# EAGLE design PK_MUV (EAGLE 9.1.3)
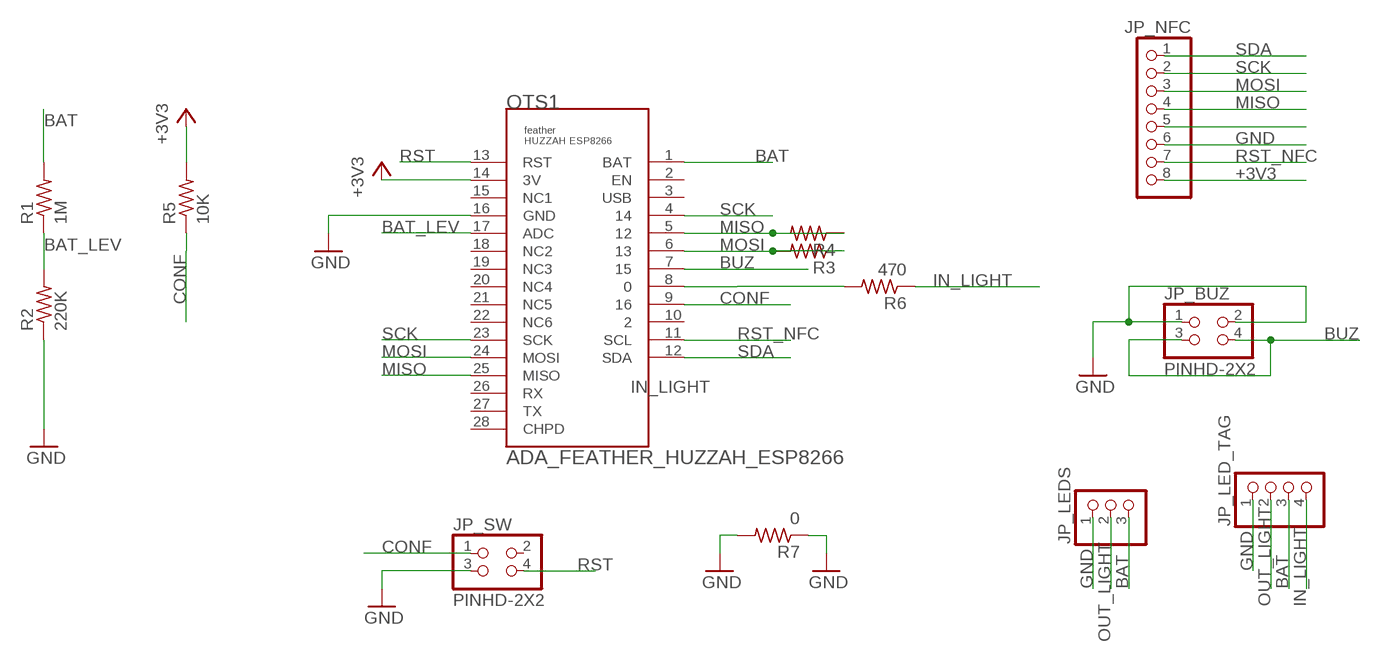
[diagram p0: schematic, sheet 1]

## Parts
JP_BUZ  PINHD-2X2  [2X2]
JP_LED_TAG  HEADER-1X4  [1X04_OVAL]
JP_LEDS  HEADER-1X3  [1X03_OVAL]
JP_NFC  HEADER-1X8  [1X08_OVAL]
JP_SW  PINHD-2X2  [2X2]
OTS1  ADA_FEATHER_HUZZAH_ESP8266  [ADA_FEATHER_HUZZAH_ESP8266]
R1  1M  R-US_M1206  [M1206]
R2  220K  R-US_M1206  [M1206]
R3  R-US_M1206  [M1206]
R4  R-US_M1206  [M1206]
R5  10K  R-US_M1206  [M1206]
R6  470  R-US_M1206  [M1206]
R7  0  R-US_M1206  [M1206]

## Nets
+3V3: JP_NFC.8 OTS1.14(3V) R5.2
BAT [power]: JP_LED_TAG.3 JP_LEDS.3 OTS1.1(BAT) R1.2
BAT_LEV: OTS1.17(ADC) R1.1 R2.2
BUZ: JP_BUZ.3 JP_BUZ.4 OTS1.7
CONF: JP_SW.1 OTS1.9 R5.1
GND [power]: JP_BUZ.1 JP_BUZ.2 JP_LED_TAG.1 JP_LEDS.1 JP_NFC.6 JP_SW.3 OTS1.16(GND) R2.1 R7.1 R7.2
IN_LIGHT: JP_LED_TAG.4 R6.1
MISO: JP_NFC.4 OTS1.5 OTS1.25(MISO) R4.1 R4.2
MOSI: JP_NFC.3 OTS1.6 OTS1.24(MOSI) R3.1 R3.2
N$1: OTS1.8 R6.2
N$5: JP_NFC.5
OUT_LIGHT: JP_LED_TAG.2 JP_LEDS.2
RST: JP_SW.4 OTS1.13(RST)
RST_NFC: JP_NFC.7 OTS1.11(SCL)
SCK: JP_NFC.2 OTS1.4 OTS1.23(SCK)
SDA: JP_NFC.1 OTS1.12(SDA)
Unconnected: JP_SW.2 OTS1.2(EN) OTS1.10 OTS1.15(NC1) OTS1.18(NC2) OTS1.19(NC3) OTS1.20(NC4) OTS1.21(NC5) OTS1.22(NC6) OTS1.26(RX) OTS1.27(TX) OTS1.28(CHPD)

## Power pins joined to a net without a drawn wire
USB: OTS1.3(USB)

## Library data of the parts
JP_BUZ JP_SW = ep:PINHD-2X2
JP_LED_TAG = microbuilder:HEADER-1X4: PIN HEADER
JP_LEDS = microbuilder:HEADER-1X3: PIN HEADER
JP_NFC = microbuilder:HEADER-1X8: PIN HEADER
OTS1 = OTS:ADA_FEATHER_HUZZAH_ESP8266: Manufacture: Adafruit Prduct number: 2821 Type: development board Measures: 51mm x 23mm x 8mm without headers Supporting materilas: product page <https://www.adafruit.com/product/2821>
R1-R7 = resistor:R-US_: RESISTOR, American symbol

## Net classes
0 default: width 0.3 mm, drill 0.8 mm, clearance 0.4 mm
1 power: width 1 mm, drill 0.8 mm, clearance 0.4 mm

## Board
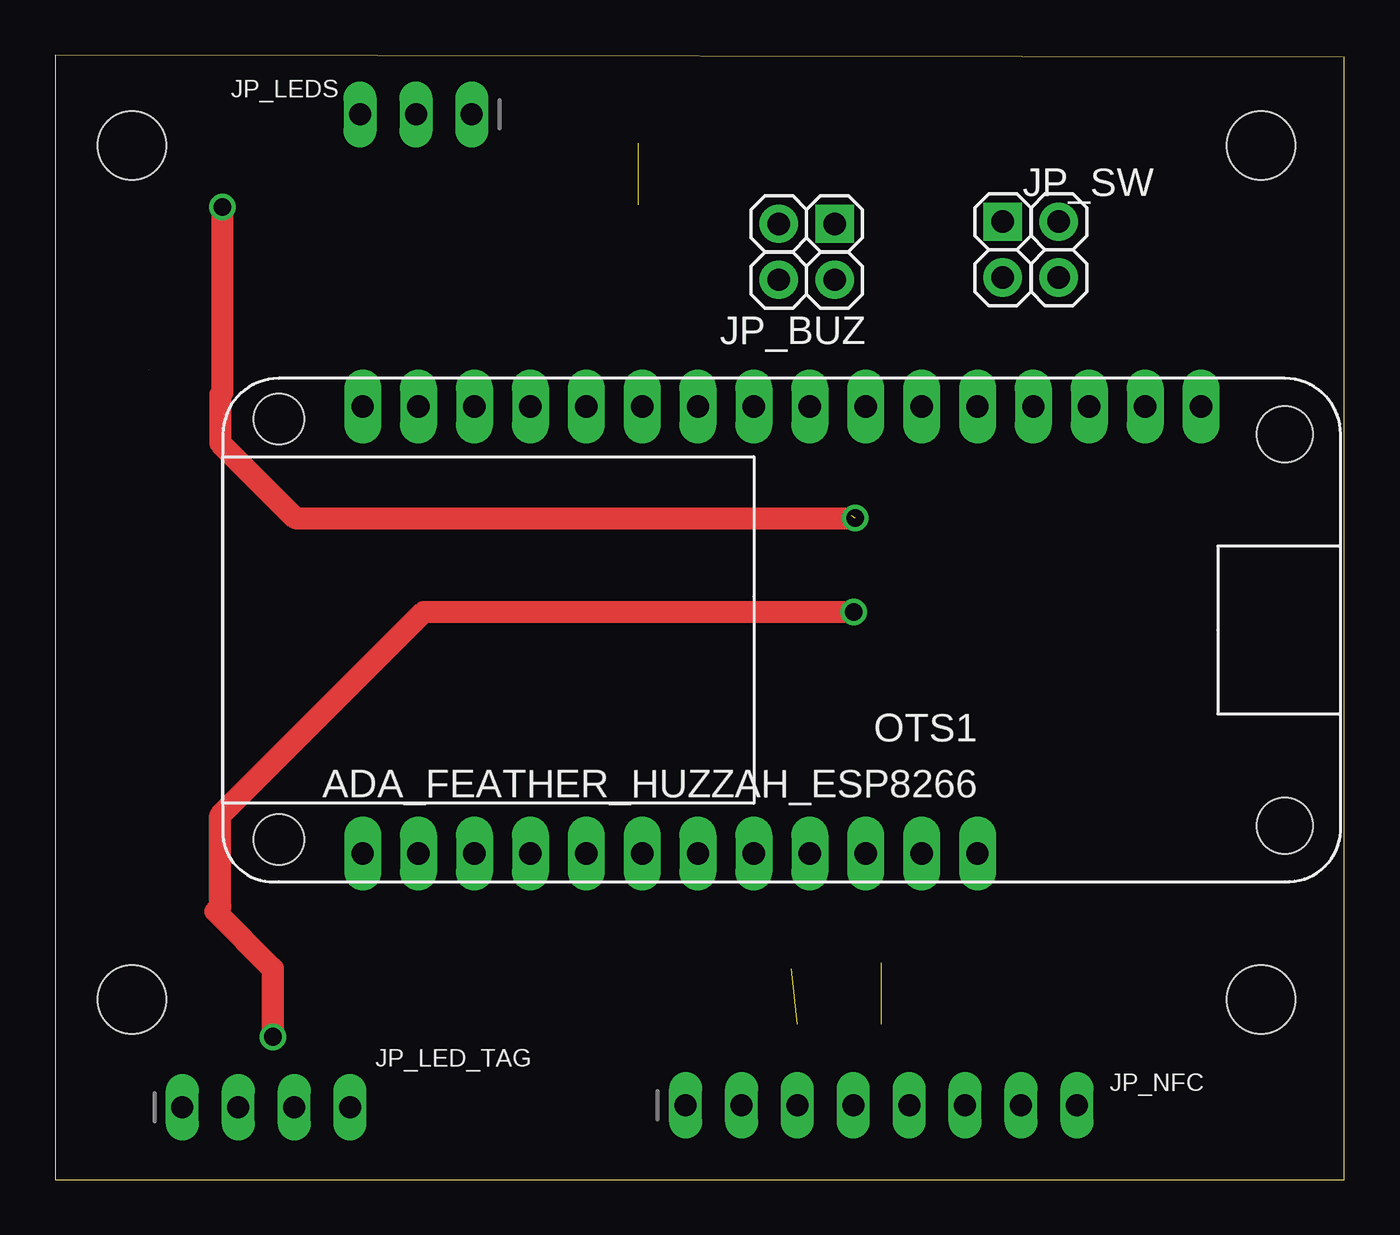
[diagram p1: board, top side]
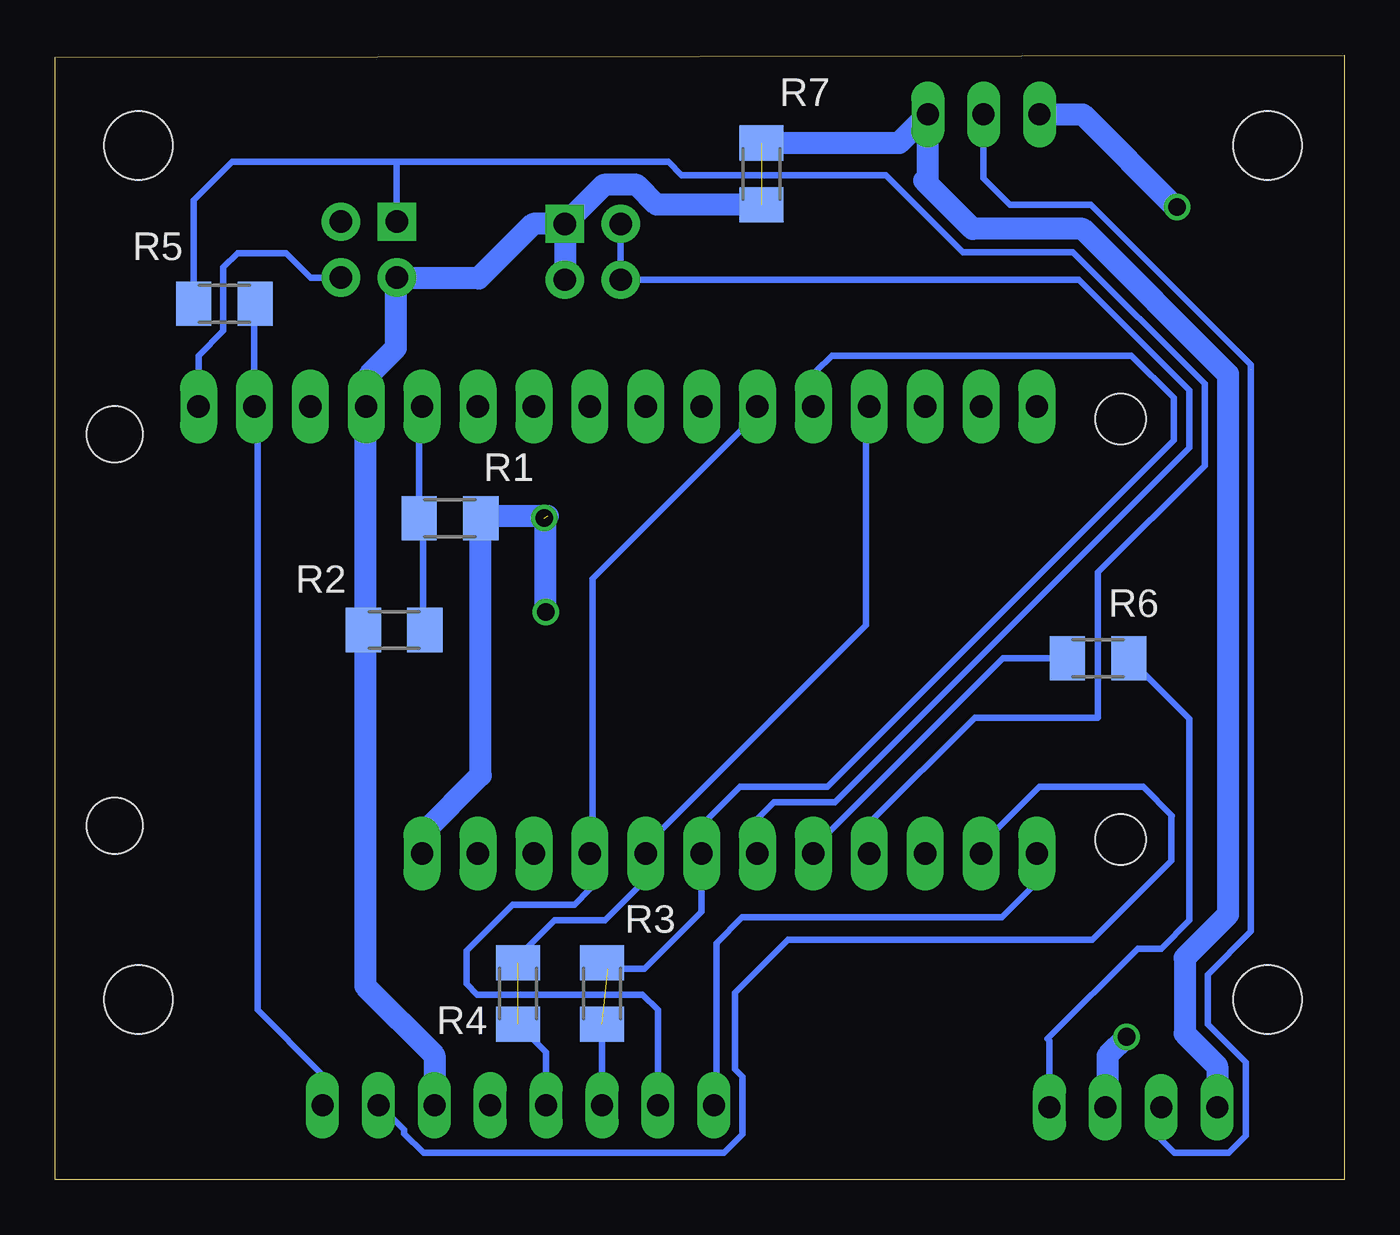
[diagram p2: board, bottom side, seen from below]

Size 58.6 x 51.1 mm. Coordinates in mm from the lower left corner, seen from the top.
Outline: 0,0 58.6,0 58.6,51 0,51.1 0,0
Copper layers (1*16): Top 0.035mm / dielectric 1.5mm / Bottom 0.035mm
Design rules "default *": minimum track width 6mil, minimum drill 0.35mm, track to track 0.4mm, track to pad 0.4mm, pad to pad 0.4mm, via to via 0.4mm, smd to smd 0.4mm, copper to edge 40mil, drill to drill 6mil, minimum pad ring 10mil, minimum via ring 8mil, stop-mask expansion 4mil, vias tented up to drill 0mil, thermal gap 10mil
Holes 3.1 mm at 3.5,8.2 54.8,8.2 54.8,47 3.5,47

### Footprints (pad centres in the part's own frame; a part is rotated, then mirrored left to right if it is on the bottom)
2X2 = drill 1.016 pad 1.738 square: 1 1.27,1.27 | drill 1.016 pad 1.738: 2 1.27,3.81; 3 3.81,1.27; 4 3.81,3.81
1X04_OVAL = drill 1 long: 1 -3.81,0; 2 -1.27,0; 3 1.27,0; 4 3.81,0
1X03_OVAL = drill 1 long: 1 -2.54,0; 2 0,0; 3 2.54,0
1X08_OVAL = drill 1 long: 1 -8.89,0; 2 -6.35,0; 3 -3.81,0; 4 -1.27,0; 5 1.27,0; 6 3.81,0; 7 6.35,0; 8 8.89,0
ADA_FEATHER_HUZZAH_ESP8266 = drill 1.016 pad 1.676 long: 1 16.51,21.59; 2 19.05,21.59; 3 21.59,21.59; 4 24.13,21.59; 5 26.67,21.59; 6 29.21,21.59; 7 31.75,21.59; 8 34.29,21.59; 9 36.83,21.59; 10 39.37,21.59; 11 41.91,21.59; 12 44.45,21.59; 13 6.35,1.27; 14 8.89,1.27; 15 11.43,1.27; 16 13.97,1.27; 17 16.51,1.27; 18 19.05,1.27; 19 21.59,1.27; 20 24.13,1.27; 21 26.67,1.27; 22 29.21,1.27; 23 31.75,1.27; 24 34.29,1.27; 25 36.83,1.27; 26 39.37,1.27; 27 41.91,1.27; 28 44.45,1.27 | hole 2.286: 48.26,1.841; 48.26,20.955 | hole 2.54: 2.54,2.54; 2.54,20.32
M1206 = smd 1.6 x 2: 1 -1.4,0; 2 1.4,0

### Placement (x,y rotation side)
JP_BUZ  36.7,44.7 180 top
JP_LED_TAG  9.6,3.3 0 top
JP_LEDS  16.4,48.4 180 top
JP_NFC  37.55,3.39 0 top
JP_SW  41.8,44.8 270 top
OTS1  58.43,36.41 180 top
R1  40.65,30.06 0 bottom
R2  43.19,24.98 0 bottom
R3  33.74,8.47 90 bottom
R4  37.55,8.47 270 bottom
R5  50.9,39.8 0 bottom
R6  11.2,23.7 180 bottom
R7  26.5,45.7 90 bottom

### Tracks (layer width: path | path; a pad name or v marks a point on that pad's centre or on a via)
+3V3
  Bottom 0.3: JP_NFC.8 46.58,3.5 46.58,4.9 49.4,7.72 49.4,35 OTS1.14 49.54,39.76 R5.2
BAT  (via drill 0.8)  (1 unrouted)
  Top 1: v7.6,44.2 7.6,35.76 7.51,35.67 7.51,33.47 10.92,30.06 v36.37,30.06 | v9.9,6.5 9.9,9.6 7.3,12.2 7.51,12.41 7.51,16.56 16.75,25.8 v36.3,25.8
  Bottom 1: OTS1.1 41.88,14.88 41.88,15.75 39.25,18.38 R1.2 39.15,30.16 36.2,30.16 | JP_LEDS.3 11.9,48.4 7.7,44.2 v7.6,44.2 | v36.3,25.8 36.3,29.99 v36.37,30.06 | JP_LED_TAG.3 10.77,3.4 10.77,5.63 v9.9,6.5
BAT_LEV
  Bottom 0.3: R2.2 41.88,25.02 41.88,29.75 42.05,29.93 R1.1 42.05,30.1 42.05,35 OTS1.17
BUZ
  Bottom 0.3: OTS1.7 26.65,14.88 26.65,16.43 25.93,17.15 23.15,17.15 7.05,33.25 7.05,35.88 12.06,40.89 JP_BUZ.4 JP_BUZ.3
CONF
  Bottom 0.3: OTS1.9 21.6,16.2 16.8,21 11.2,21 11.2,27.6 | R5.1 52.3,44.5 51.17,45.62 50.55,46.25 43.1,46.25 | 6.35,36 6.35,32.45 11.2,27.6 | 6.35,36 6.35,36.16 | 6.35,36 6.35,36.16 | 20.84,45.65 17.34,42.15 12.34,42.15 6.35,36.16 | 20.84,45.65 | 20.84,45.65 | 20.84,45.65 30.12,45.65 30.72,46.25 43.1,46.25 | 43.1,46.25 43.07,46.22 JP_SW.1 | 11.2,27.6
GND  (1 unrouted)
  Bottom 1: JP_BUZ.1 JP_BUZ.2 | 43.1,40.96 43.1,37.8 44.33,36.58 44.33,35.27 OTS1.16 44.5,35 44.5,25.02 R2.1 44.5,24.5 44.5,8.8 41.36,5.66 JP_NFC.6 | 43.1,40.96 JP_SW.3 | 43.1,40.96 43.09,40.95 39.35,40.95 36.87,43.43 JP_BUZ.1 | 18.94,45.24 16.9,43.2 11.9,43.2 5.3,36.6 5.3,12.05 7.27,10.08 7.27,6.64 5.79,5.16 JP_LED_TAG.1 | 18.94,45.24 JP_LEDS.1 20.24,47.1 R7.2 | 19.1,45.4 18.94,45.24 | R7.1 31.26,44.3 32.16,45.2 33.66,45.2 JP_BUZ.1
IN_LIGHT
  Bottom 0.3: R6.1 7.05,20.95 7.05,11.79 8.33,10.51 9.39,10.51 13.5,6.4 13.41,6.31 JP_LED_TAG.4
MISO  (1 unrouted)
  Bottom 0.3: 31.73,14.35 31.73,14.7 OTS1.5 | 36.42,3.5 JP_NFC.4 36.28,5.8 R4.2 | OTS1.25 21.75,35 21.75,25.2 31.73,15.22 31.73,14.88 OTS1.5 | 38.07,9.87 37.6,9.87 | 37.6,9.87 R4.1 | OTS1.5 31.76,13.64 33.6,11.8 35.9,11.8 37.6,10.1 37.6,9.87
MOSI  (1 unrouted)
  Bottom 0.3: 29.1,14.35 29.1,14.7 OTS1.6 | 33.8,3.5 JP_NFC.3 R3.1 | OTS1.24 24.02,35.17 24.02,36.73 23.3,37.45 9.68,37.45 7.75,35.52 7.75,33.6 23.5,17.85 27.48,17.85 29.1,16.23 29.1,14.88 OTS1.6 | OTS1.6 29.2,14.8 | 34.13,9.87 R3.2 33.47,9.6 31.8,9.6 29.22,12.18 OTS1.6
N$1
  Bottom 0.3: R6.2 15.52,23.7 23.99,15.23 23.99,15.17 24.14,15.02 OTS1.8
OUT_LIGHT  (1 unrouted)
  Bottom 0.3: 4.25,36.8 4.25,37.03 11.52,44.3 15.2,44.3 16.4,45.5 JP_LEDS.2 | 4.25,36.8 4.25,11.29 6.22,9.32 6.22,7.08 4.49,5.34 4.49,2.01 5.15,1.35 5.25,1.24 7.74,1.24 8.33,1.83 JP_LED_TAG.2 | 4.25,36.8
RST
  Bottom 0.3: OTS1.13 52.08,37.44 50.95,38.57 50.95,41.45 50.3,42.1 48.1,42.1 46.99,40.99 JP_SW.4
RST_NFC
  Bottom 0.3: JP_NFC.7 43.77,3.33 42.73,2.27 42.73,2.1 41.85,1.23 28.2,1.23 27.36,2.07 27.36,4.68 27.7,5.03 27.7,8.5 25.3,10.9 11.46,10.9 7.86,14.5 7.86,16.54 7.85,16.55 9.15,17.85 13.88,17.85 16.5,15.22 16.5,14.88 OTS1.11
SCK
  Bottom 0.3: OTS1.23 26.82,35 26.82,34.65 34.17,27.3 34.17,14.88 OTS1.4 34.3,13.2 35,12.5 37.8,12.5 39.9,10.4 39.9,8.9 39.42,8.42 31.9,8.42 31.2,7.72 JP_NFC.2
SDA
  Bottom 0.3: JP_NFC.1 28.55,3.5 28.55,10.75 27.38,11.92 15.58,11.92 13.98,13.52 OTS1.12